# EAGLE design B133C (EAGLE 6.6.0)
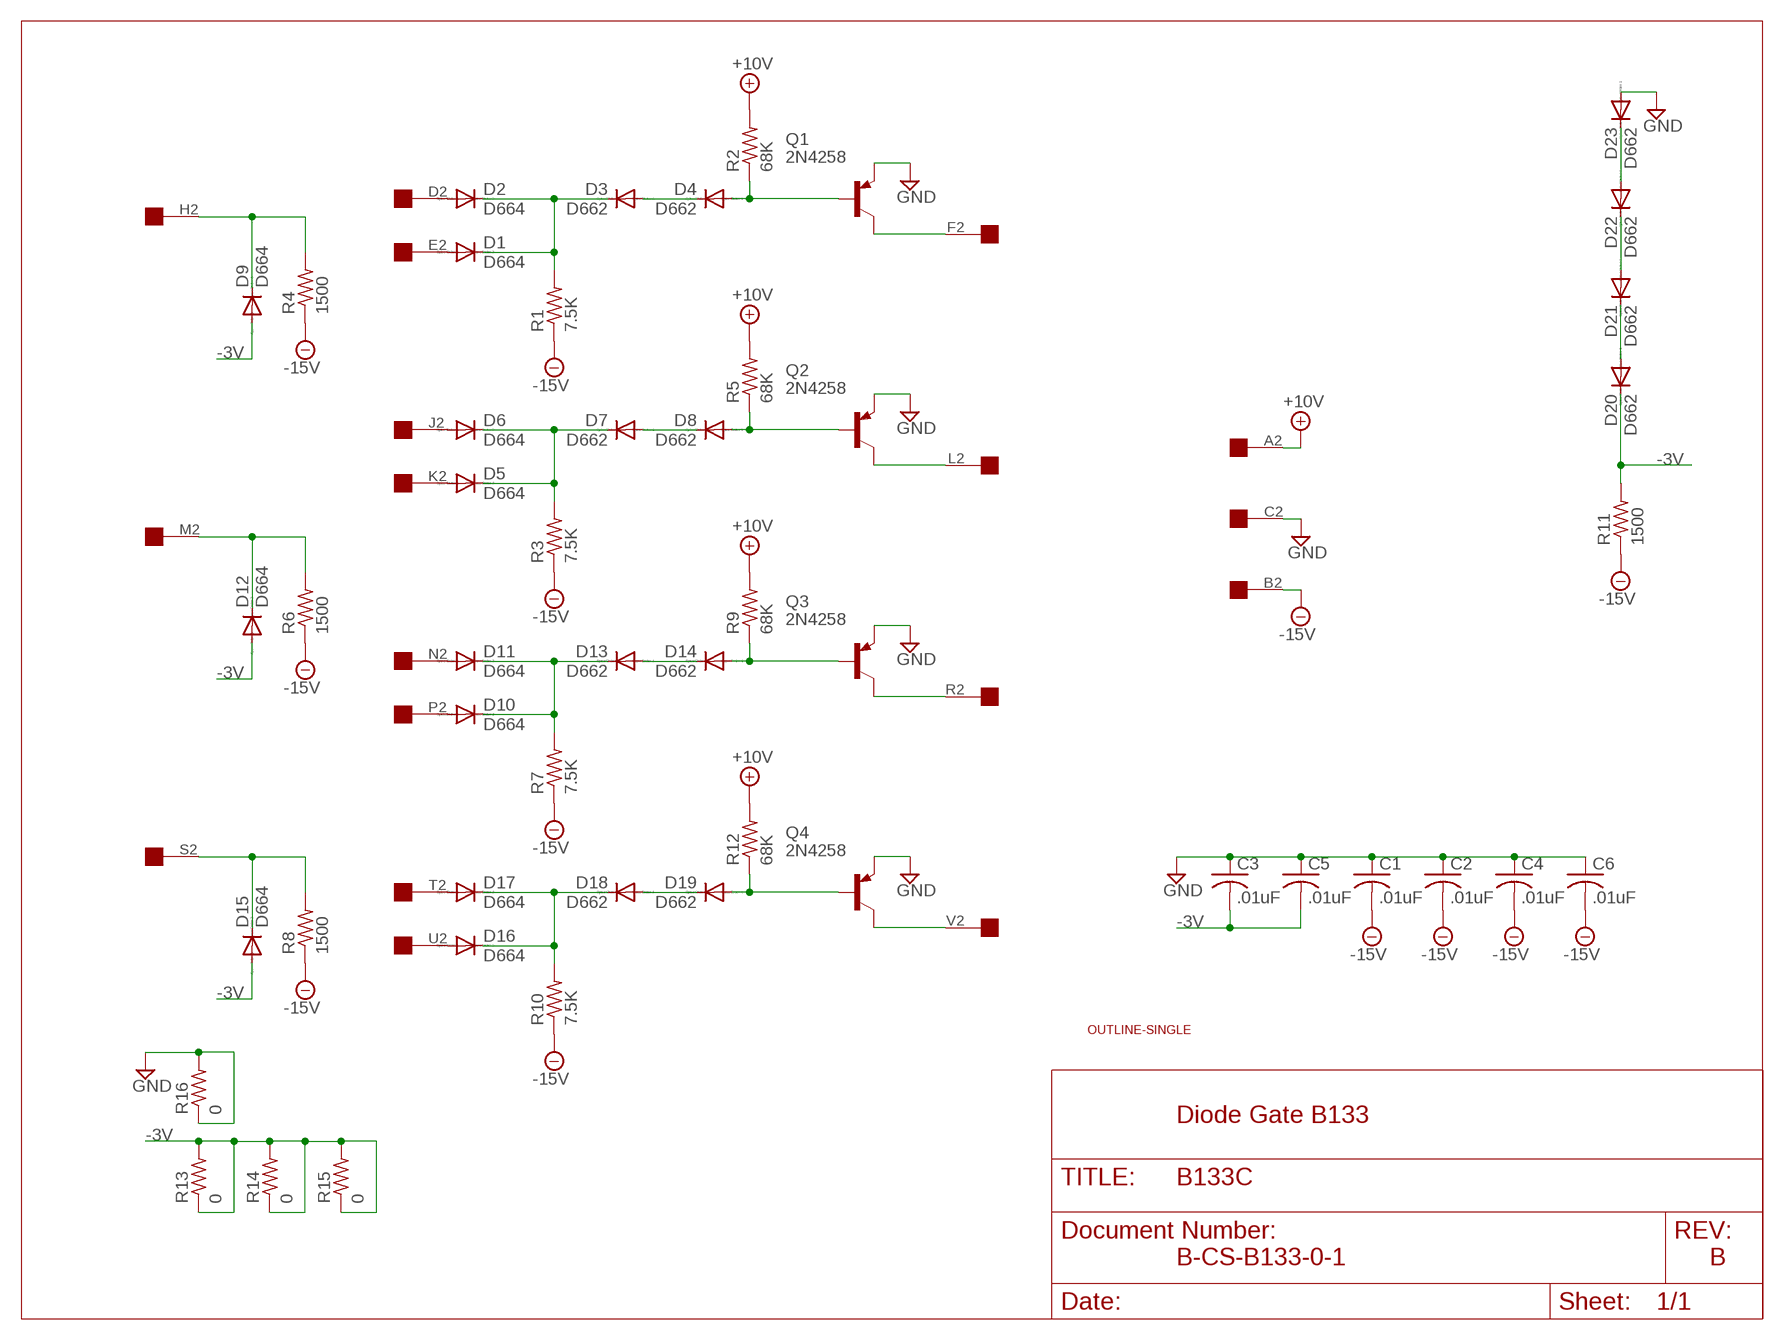
[diagram p0: schematic, sheet 1]

## Parts
C1  .01uF  C-US  [C063-025X075]
C2  .01uF  C-US  [C063-025X075]
C3  .01uF  C-US  [C063-025X075]
C4  .01uF  C-US  [C063-025X075]
C5  .01uF  C-US  [C063-025X075]
C6  .01uF  C-US  [C063-025X075]
D1  D664  DIODE-DO35-10  [DO35-10]
D2  D664  DIODE-DO35-10  [DO35-10]
D3  D662  DIODE-DO35-10  [DO35-10]
D4  D662  DIODE-DO35-10  [DO35-10]
D5  D664  DIODE-DO35-10  [DO35-10]
D6  D664  DIODE-DO35-10  [DO35-10]
D7  D662  DIODE-DO35-10  [DO35-10]
D8  D662  DIODE-DO35-10  [DO35-10]
D9  D664  DIODE-DO35-10  [DO35-10]
D10  D664  DIODE-DO35-10  [DO35-10]
D11  D664  DIODE-DO35-10  [DO35-10]
D12  D664  DIODE-DO35-10  [DO35-10]
D13  D662  DIODE-DO35-10  [DO35-10]
D14  D662  DIODE-DO35-10  [DO35-10]
D15  D664  DIODE-DO35-10  [DO35-10]
D16  D664  DIODE-DO35-10  [DO35-10]
D17  D664  DIODE-DO35-10  [DO35-10]
D18  D662  DIODE-DO35-10  [DO35-10]
D19  D662  DIODE-DO35-10  [DO35-10]
D20  D662  DIODE-DO35-10  [DO35-10]
D21  D662  DIODE-DO35-10  [DO35-10]
D22  D662  DIODE-DO35-10  [DO35-10]
D23  D662  DIODE-DO35-10  [DO35-10]
Q1  2N4258  -PNP-TO5  [TO5]
Q2  2N4258  -PNP-TO5  [TO5]
Q3  2N4258  -PNP-TO5  [TO5]
Q4  2N4258  -PNP-TO5  [TO5]
R1  7.5K  R-US_0207/10  [0207/10]
R2  68K  R-US_0207/10  [0207/10]
R3  7.5K  R-US_0207/10  [0207/10]
R4  1500  R-US_0207/10  [0207/10]
R5  68K  R-US_0207/10  [0207/10]
R6  1500  R-US_0207/10  [0207/10]
R7  7.5K  R-US_0207/10  [0207/10]
R8  1500  R-US_0207/10  [0207/10]
R9  68K  R-US_0207/10  [0207/10]
R10  7.5K  R-US_0207/10  [0207/10]
R11  1500  R-US_0207/10  [0207/10]
R12  68K  R-US_0207/10  [0207/10]
R13  0  R-US_0207/10  [0207/10]
R14  0  R-US_0207/10  [0207/10]
R15  0  R-US_0207/10  [0207/10]
R16  0  R-US_0207/10  [0207/10]
U$1  OUTLINE-SINGLE  [SINGLE]
U$2  EDGE-1  [EDGE-CON1]

## Nets
+10V: R2.2 R5.2 R9.2 R12.2 U$2.A2
-3V [Supply]: C3.2 C5.2 D9.A D12.A D15.A D20.C R11.2 R13.1 R13.2 R14.1 R14.2 R15.1 R15.2
-15V: C1.2 C2.2 C4.2 C6.2 R1.1 R3.1 R4.1 R6.1 R7.1 R8.1 R10.1 R11.1 U$2.B2
GND [Supply]: C1.1 C2.1 C3.1 C4.1 C5.1 C6.1 D23.A Q1.1(E) Q2.1(E) Q3.1(E) Q4.1(E) R16.1 R16.2 U$2.C2
N$1: D5.C D6.C D7.C R3.2
N$2: D16.C D17.C D18.C R10.2
N$3: D4.A Q1.2(B) R2.1
N$4: D1.A U$2.E2
N$5: D1.C D2.C D3.C R1.2
N$6: D6.A U$2.J2
N$7: D5.A U$2.K2
N$8: D18.A D19.C
N$9: D7.A D8.C
N$10: D2.A U$2.D2
N$11: Q1.3(C) U$2.F2
N$12: D8.A Q2.2(B) R5.1
N$13: Q2.3(C) U$2.L2
N$14: D10.C D11.C D13.C R7.2
N$15: D3.A D4.C
N$16: D11.A U$2.N2
N$17: D9.C R4.2 U$2.H2
N$18: D10.A U$2.P2
N$19: D17.A U$2.T2
N$20: D12.C R6.2 U$2.M2
N$21: D13.A D14.C
N$22: D14.A Q3.2(B) R9.1
N$23: Q3.3(C) U$2.R2
N$24: D19.A Q4.2(B) R12.1
N$25: D15.C R8.2 U$2.S2
N$26: D22.A D23.C
N$27: D21.A D22.C
N$28: Q4.3(C) U$2.V2
N$29: D20.A D21.C
N$30: D16.A U$2.U2

## Notes on the sheet
- Diode Gate B133
- B-CS-B133-0-1 | B

## Library data of the parts
C1-C6 = dec-con:C-US: Capacitors with funky DEC lead spacing.
D1-D23 = diode:DIODE-: DIODE
Q1-Q4 = transistor:*-PNP-: PNP Transistror
R1-R16 = rcl:R-US_: RESISTOR, American symbol
U$1 = dec-con:OUTLINE-*: Board outlines for DEC boards.
U$2 = dec-con:EDGE-1: Single-Sided DEC Edge Connector -- (side 2)

## Net classes
0 default: width 0.813 mm
1 Supply: width 0.813 mm

## Board
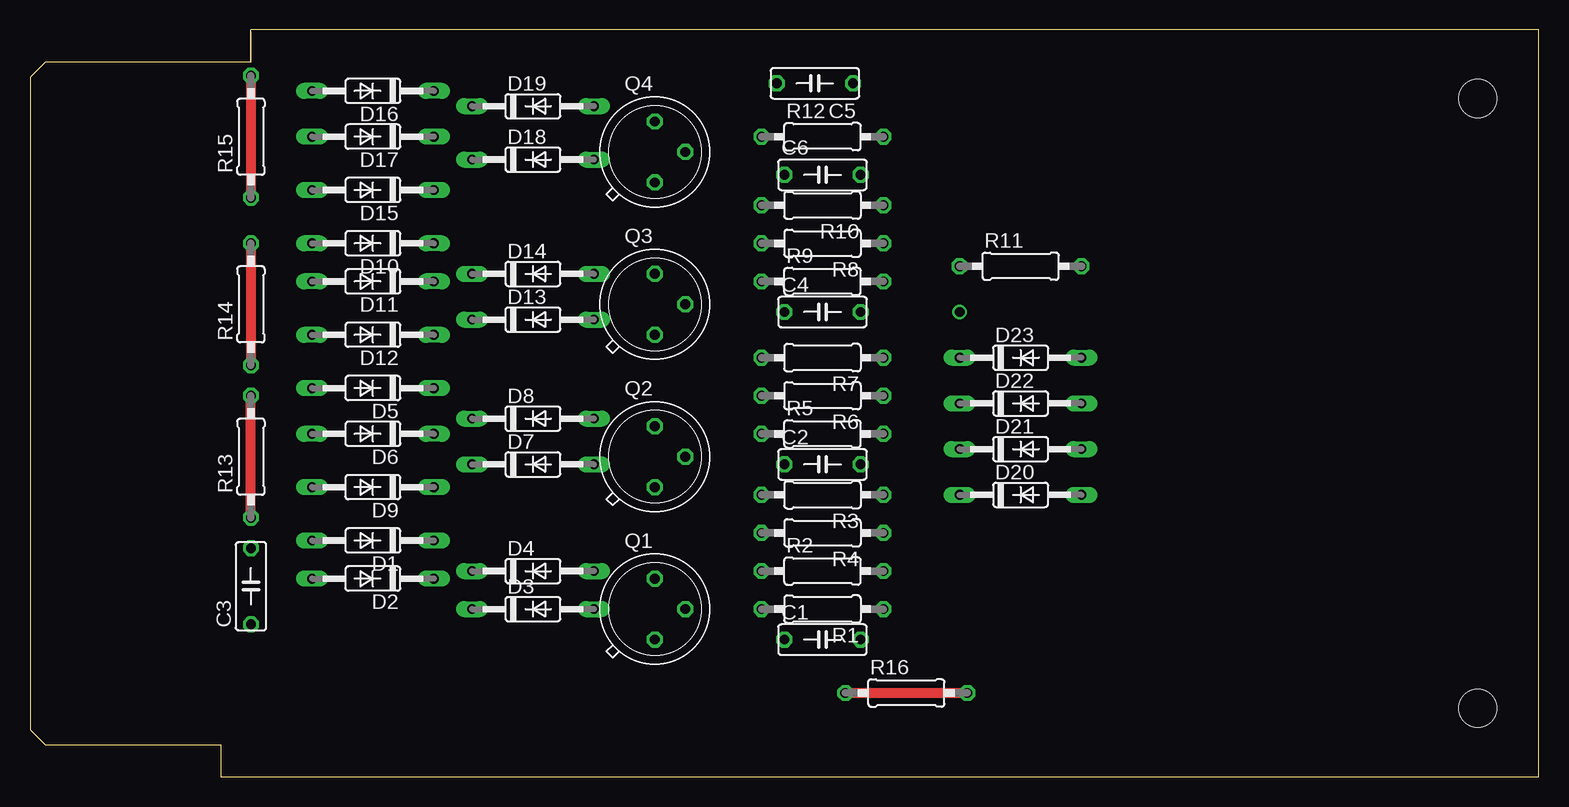
[diagram p1: board, top side]
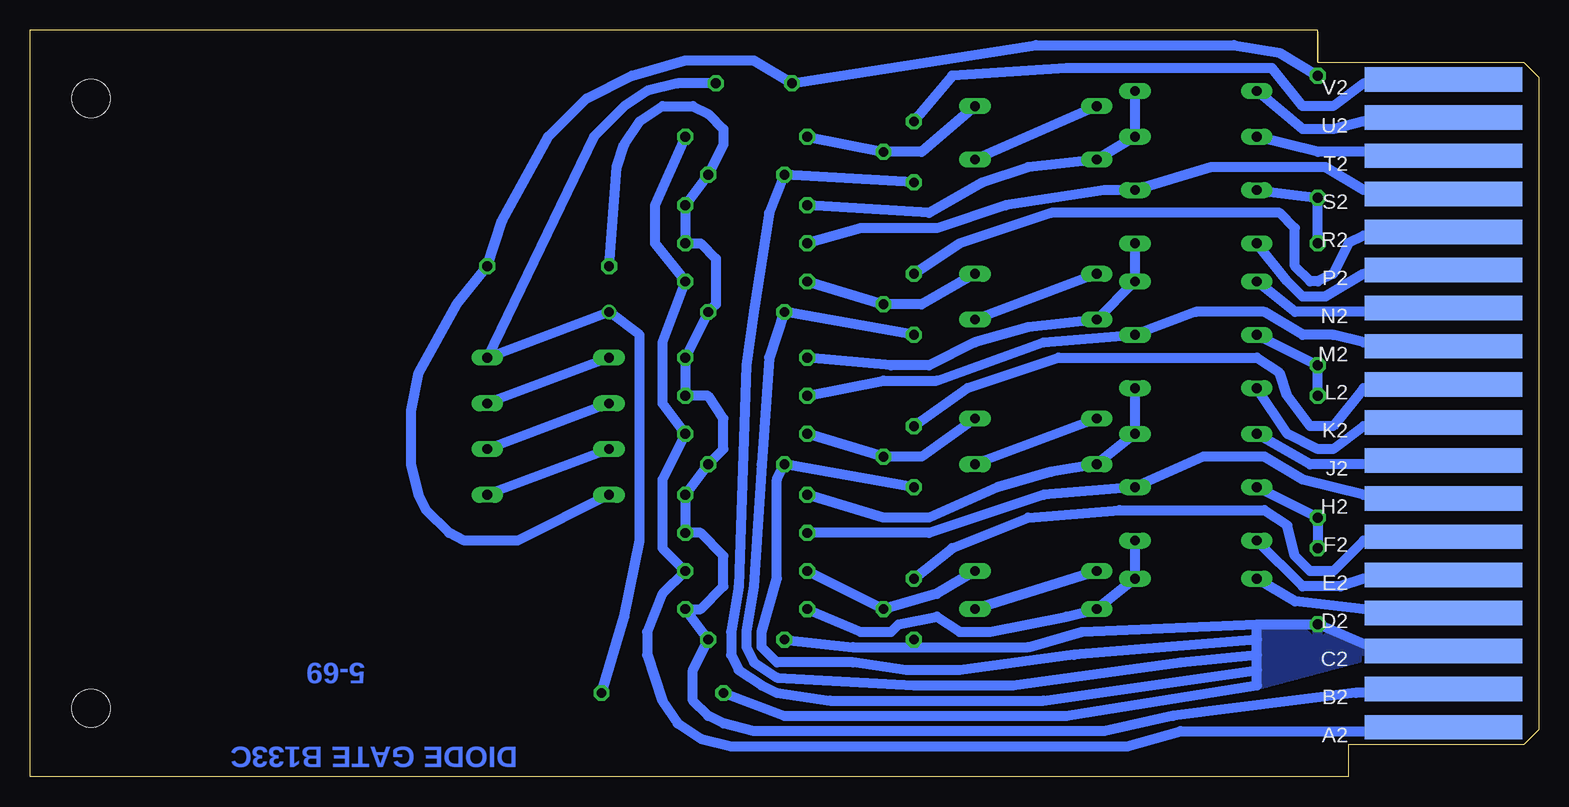
[diagram p2: board, bottom side, seen from below]

Size 125.73 x 62.23 mm. Coordinates in mm from the lower left corner, seen from the top.
Copper layers (1+16): Top 0.035mm / dielectric 1.5mm / Bottom 0.035mm
Design rules "16mils": minimum track width 16mil, minimum drill 32mil, track to track 15mil, track to pad 10mil, pad to pad 10mil, via to via 10mil, smd to smd 10mil, copper to edge 13mil, drill to drill 10mil, minimum pad ring 10mil, minimum via ring 8mil, stop-mask expansion 0mil, vias tented up to drill 0mil, thermal gap 10mil

### Footprints (pad centres in the part's own frame; a part is rotated, then mirrored left to right if it is on the bottom)
C063-025X075 = drill 0.813 octagon: 1 -2.54,0; 2 3.81,0
DO35-10 = drill 0.813 long: A 5.08,0; C -5.08,0
TO5 = drill 0.813 octagon: 1 0,-2.54; 2 2.54,0; 3 0,2.54
0207/10 = drill 0.813 octagon: 1 -5.08,0; 2 5.08,0
SINGLE = hole 3.175: 120.65,56.515; 120.65,5.715
EDGE-CON1 = smd 13.106 x 2.032 bottom: A2 7.938,4.128; B2 7.938,7.303; C2 7.938,10.477; D2 7.938,13.652; E2 7.938,16.828; F2 7.938,20.003; H2 7.938,23.177; J2 7.938,26.352; K2 7.938,29.527; L2 7.938,32.703; M2 7.938,35.877; N2 7.938,39.053; P2 7.938,42.227; R2 7.938,45.403; S2 7.938,48.578; T2 7.938,51.752; U2 7.938,54.928; V2 7.938,58.102

### Placement (x,y rotation side)
C1  65.41,11.43 0 top
C2  65.41,26.04 0 top
C3  18.42,15.24 90 top
C4  65.41,38.73 0 top
C5  66.04,57.78 180 top
C6  65.41,50.16 0 top
D1  28.58,19.68 180 top
D2  28.58,16.51 180 top
D3  41.91,13.97 0 top
D4  41.91,17.14 0 top
D5  28.58,32.38 180 top
D6  28.58,28.57 180 top
D7  41.91,26.04 0 top
D8  41.91,29.84 0 top
D9  28.58,24.13 180 top
D10  28.58,44.45 180 top
D11  28.58,41.27 180 top
D12  28.58,36.83 180 top
D13  41.91,38.1 0 top
D14  41.91,41.91 0 top
D15  28.58,48.9 180 top
D16  28.58,57.15 180 top
D17  28.58,53.34 180 top
D18  41.91,51.44 0 top
D19  41.91,55.88 0 top
D20  82.55,23.5 0 top
D21  82.55,27.3 0 top
D22  82.55,31.11 0 top
D23  82.55,34.92 0 top
Q1  52.07,13.97 0 top
Q2  52.07,26.67 0 top
Q3  52.07,39.37 0 top
Q4  52.07,52.07 0 top
R1  66.04,13.97 180 top
R2  66.04,17.14 0 top
R3  66.04,23.5 180 top
R4  66.04,20.32 180 top
R5  66.04,28.57 0 top
R6  66.04,31.75 180 top
R7  66.04,34.92 180 top
R8  66.04,44.45 180 top
R9  66.04,41.27 0 top
R10  66.04,47.62 180 top
R11  82.55,42.55 0 top
R12  66.04,53.34 0 top
R13  18.42,26.67 90 top
R14  18.42,39.37 90 top
R15  18.42,53.34 90 top
R16  73.03,6.99 0 top
U$1  0,0 0 top
U$2  0,0 0 top

### Tracks (layer width: path | path; a pad name or v marks a point on that pad's centre or on a via)
+10V
  Bottom 0.813: R12.2 73.66,47.62 73.66,44.45 R9.2 73.03,36.2 73.03,31.11 R5.2 73.03,24.77 73.03,19.05 R2.2 73.03,15.24 74.3,12.06 74.3,10.16 73.03,6.35 71.76,4.45 69.85,3.17 67.31,2.54 34.29,2.54 29.85,3.81 8.26,3.81 U$2.A2
-3V
  Top 0.813: R15.2 R15.1 | R14.2 R14.1 | R13.1 R13.2
  Bottom 0.813: D9.A R13.1 C3.2 | R13.2 R14.1 D12.A | D15.A R15.1 R14.2 | R15.2 21.59,60.33 25.4,60.96 41.91,60.96 C5.2 65.41,59.69 71.12,59.69 75.57,58.42 79.38,56.52 82.55,53.34 86.36,46.35 R11.2 90.17,39.37 93.35,33.66 93.98,30.48 93.98,26.04 93.35,23.5 92.71,22.23 90.81,20.32 89.54,19.68 85.09,19.68 D20.C
-15V
  Bottom 0.813: R11.1 76.84,50.8 76.2,52.7 74.93,54.61 73.03,55.88 70.49,55.88 69.22,55.24 67.95,53.98 67.95,52.7 C6.2 R10.1 R8.1 69.85,44.45 68.58,43.18 68.58,39.37 C4.2 R7.1 R6.1 69.22,31.75 67.95,29.84 67.95,27.3 C2.2 R3.1 R4.1 69.85,20.32 67.95,18.41 67.95,15.88 69.85,13.97 R1.1 C1.2 70.49,8.89 70.49,6.35 69.22,5.08 67.95,4.45 65.41,3.81 36.2,3.81 30.48,5.08 15.24,6.99 8.89,6.99 U$2.B2
GND  (via drill 0.81)
  Top 0.813: R16.1 R16.2
  Bottom 0.813: C5.1 71.76,57.78 74.3,57.15 76.2,55.88 78.74,53.34 D23.A v77.47,38.73 74.93,36.83 74.93,19.68 76.2,13.34 R16.2 | R16.1 62.87,5.08 39.37,5.08 23.5,7.62 23.5,8.89 | 23.5,8.89 23.5,10.16 | 23.5,10.16 23.5,11.43 | 23.5,11.43 23.5,12.7 | 23.5,12.7 C3.1 13.97,10.79 8.26,10.79 U$2.C2 | 52.07,10.79 42.55,10.79 38.1,12.06 23.5,12.7 | C1.1 57.15,10.79 52.07,10.79 | 52.07,10.79 Q1.1 | Q3.1 C4.1 64.14,34.92 64.77,26.04 65.41,15.88 66.04,12.06 66.04,10.79 65.41,9.53 63.5,8.26 52.07,7.62 43.82,7.62 29.85,9.53 23.5,10.16 | Q4.1 C6.1 64.14,46.99 65.41,38.73 66.04,34.29 66.68,15.88 67.31,12.06 67.31,10.16 66.68,8.89 64.77,7.62 63.5,6.99 59.06,6.35 41.28,6.35 23.5,8.89 | Q2.1 C2.1 63.5,24.77 63.5,16.51 64.77,12.06 64.77,10.79 63.5,9.53 57.15,9.53 52.71,8.89 48.26,8.89 38.74,10.16 23.5,11.43
  pour Bottom: 13.97,10.79 13.97,10.16 23.5,7.62 23.5,12.7 18.42,12.7
N$1
  Bottom 0.813: D5.C D6.C D7.C 40.64,25.4 45.09,24.13 50.8,21.59 54.61,21.59 R3.2
N$2
  Bottom 0.813: D16.C D17.C D18.C 42.55,50.8 46.36,49.53 50.8,46.99 R10.2
N$3
  Bottom 0.813: D4.A 50.17,15.24 Q1.2 R2.1
N$4
  Bottom 0.813: U$2.E2 8.89,16.51 14.61,16.51 16.51,15.88 19.69,15.88 D1.A
N$5
  Bottom 0.813: D1.C D2.C D3.C 39.37,13.34 45.72,12.06 48.26,12.06 50.17,13.34 53.34,12.7 53.98,12.06 56.52,12.06 R1.2
N$6
  Bottom 0.813: U$2.J2 8.89,26.04 19.05,26.04 D6.A
N$7
  Bottom 0.813: U$2.K2 8.89,29.21 14.61,29.21 17.15,27.3 18.42,27.3 20.96,28.57 D5.A
N$8
  Bottom 0.813: D19.C D18.A
N$9
  Bottom 0.813: D8.C D7.A
N$10
  Bottom 0.813: U$2.D2 8.89,13.97 13.97,13.97 14.61,13.97 20.32,14.61 D2.A
N$11
  Bottom 0.813: Q1.3 48.9,19.05 42.55,21.59 34.93,22.23 22.86,22.23 20.96,20.95 20.32,18.41 19.05,17.14 17.15,17.14 14.61,19.68 8.89,19.68 U$2.F2
N$12
  Bottom 0.813: D8.A 51.44,26.67 Q2.2 R5.1
N$13
  Bottom 0.813: Q2.3 47.63,32.38 40.01,34.92 23.5,34.92 21.59,33.66 20.96,31.75 19.05,29.21 17.15,29.21 14.61,32.38 8.89,32.38 U$2.L2
N$14
  Bottom 0.813: D10.C D11.C D13.C 42.55,37.47 46.99,36.2 50.8,34.29 53.98,34.29 R7.2
N$15
  Bottom 0.813: D4.C D3.A
N$16
  Bottom 0.813: U$2.N2 8.89,38.73 20.32,38.73 D11.A
N$17
  Bottom 0.813: U$2.H2 8.89,23.5 14.61,23.5 19.69,24.77 22.86,26.67 27.94,26.67 D9.C 41.28,23.5 50.8,20.32 R4.2
N$18
  Bottom 0.813: U$2.P2 8.89,41.91 14.61,41.91 17.78,40.01 19.69,40.01 20.96,41.27 D10.A
N$19
  Bottom 0.813: U$2.T2 8.26,52.07 18.42,52.07 D17.A
N$20
  Bottom 0.813: U$2.M2 8.26,36.2 14.61,36.2 17.15,36.83 19.69,36.83 22.86,38.73 28.58,38.73 D12.C 41.28,36.2 50.17,33.02 54.61,33.02 R6.2
N$21
  Bottom 0.813: D14.C D13.A
N$22
  Bottom 0.813: R9.1 Q3.2 51.44,39.37 D14.A
N$23
  Bottom 0.813: U$2.R2 8.89,45.09 14.61,45.09 15.88,44.45 17.15,41.91 18.42,41.27 19.05,41.27 20.32,42.55 20.32,45.72 21.59,46.99 40.64,46.99 48.26,44.45 Q3.3
N$24
  Bottom 0.813: D19.A 51.44,52.07 Q4.2 R12.1
N$25
  Bottom 0.813: U$2.S2 8.26,48.9 14.61,48.9 17.78,50.8 27.31,50.8 D15.C 36.2,48.9 44.45,47.62 50.17,45.72 56.52,45.72 R8.2
N$26
  Bottom 0.813: D23.C D22.A
N$27
  Bottom 0.813: D22.C D21.A
N$28
  Bottom 0.813: U$2.V2 8.89,57.78 14.61,57.78 17.15,55.88 19.69,55.88 22.23,59.05 39.37,59.05 48.9,58.42 Q4.3
N$29
  Bottom 0.813: D21.C D20.A
N$30
  Bottom 0.813: U$2.U2 8.26,54.61 14.61,54.61 17.15,53.98 19.69,53.98 D16.A

### Text on the board
Bottom: 5-69 | DIODE GATE B133C